# Altium project power-v3.2.PrjPCB (part 2 of 2)

## Sheet communication.SchDoc
size A4; SheetNumber: 8
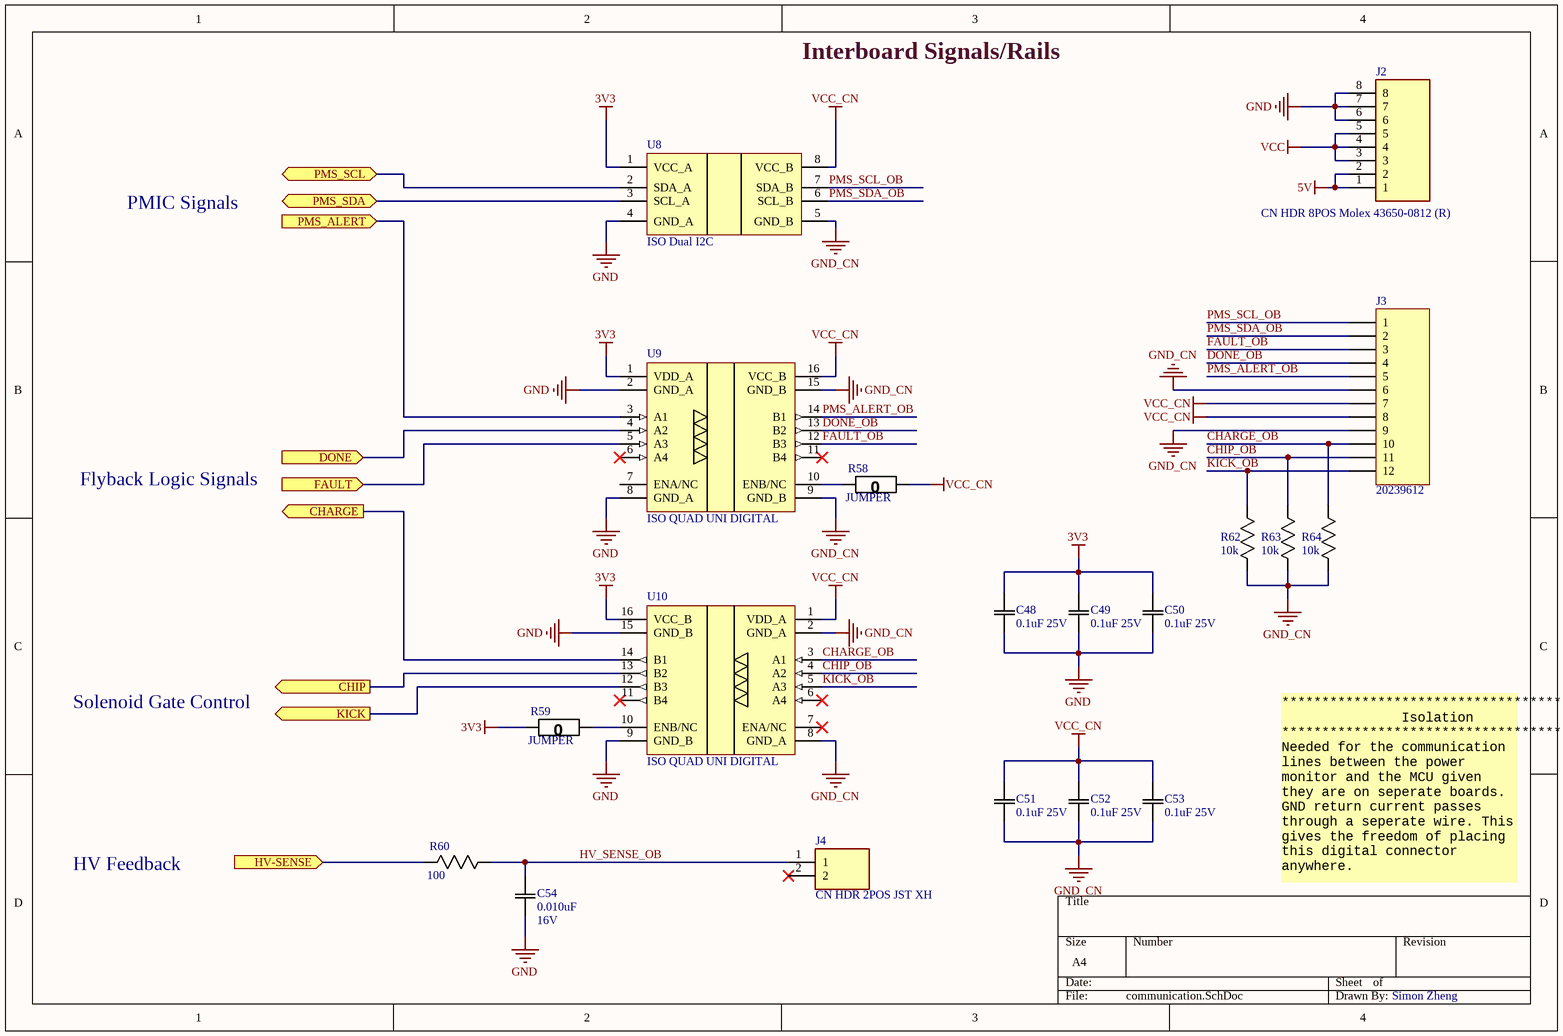
[diagram p6: communication.SchDoc]

### Parts
C48  0.1uF 25V  [0805]
C49  0.1uF 25V  [0805]
C50  0.1uF 25V  [0805]
C51  0.1uF 25V  [0805]
C52  0.1uF 25V  [0805]
C53  0.1uF 25V  [0805]
C54  Rating: 16V  [0805]  (hidden comment: 0.010uF)
J2  CN HDR 8POS Molex 43650-0812 (R)  [CN 43650-0812]
J3  20239612  [CN 20239612]
J4  CN HDR 2POS JST XH  [JST_S2B-XH-A(LF)(SN)]
R58  JUMPER  [0805]
R59  JUMPER  [0805]
R60  100  [0805]
R62  10k  [0805]
R63  10k  [0805]
R64  10k  [0805]
U8  ISO Dual I2C  [SOIC127P600X175-8N]
U9  ISO QUAD UNI DIGITAL  [SOIC127P600X175-16N]
U10  ISO QUAD UNI DIGITAL  [SOIC127P600X175-16N]

### Ports
CHARGE (out), CHIP (out), DONE (in), FAULT (in), HV-SENSE (in), KICK (out), PMS_ALERT (in), PMS_SCL (bidir), PMS_SDA (bidir)

### Nets
3V3: C48.1(C1) C49.1(C1) C50.1(C1) R59.2(R2) U8.1(VCC_A) U9.1(VDD_A) U10.16(VCC_B)
5V: J2.1 J2.2
GND: C48.2(C2) C49.2(C2) C50.2(C2) C54.2(C2) J2.6 J2.7 J2.8 U8.4(GND_A) U9.2(GND_A) U9.8(GND_A) U10.9(GND_B) U10.15(GND_B)
GND_CN: C51.2(C2) C52.2(C2) C53.2(C2) J3.6 J3.9 R62.2(R2) R63.2(R2) R64.2(R2) U8.5(GND_B) U9.9(GND_B) U9.15(GND_B) U10.2(GND_A) U10.8(GND_A)
VCC: J2.3 J2.4 J2.5
VCC_CN: C51.1(C1) C52.1(C1) C53.1(C1) J3.7 J3.8 R58.1(R1) U8.8(VCC_B) U9.16(VCC_B) U10.1(VDD_A)
CHARGE: U10.14(B1) ; port CHARGE
CHARGE_OB: J3.10 R64.1(R1) U10.3(A1)
CHIP: U10.13(B2) ; port CHIP
CHIP_OB: J3.11 R63.1(R1) U10.4(A2)
DONE: U9.4(A2) ; port DONE
DONE_OB: J3.4 U9.13(B2)
FAULT: U9.5(A3) ; port FAULT
FAULT_OB: J3.3 U9.12(B3)
HV-SENSE: R60.2(R2) ; port HV-SENSE
HV_SENSE_OB: C54.1(C1) J4.1 R60.1(R1)
KICK: U10.12(B3) ; port KICK
KICK_OB: J3.12 R62.1(R1) U10.5(A3)
PMS_ALERT: U9.3(A1) ; port PMS_ALERT
PMS_ALERT_OB: J3.5 U9.14(B1)
PMS_SCL: U8.2(SDA_A) ; port PMS_SCL
PMS_SCL_OB: J3.1 U8.7(SDA_B)
PMS_SDA: U8.3(SCL_A) ; port PMS_SDA
PMS_SDA_OB: J3.2 U8.6(SCL_B)
NetR58_2: R58.2(R2) U9.10(ENB/NC)
NetR59_1: R59.1(R1) U10.10(ENB/NC)

Not connected (* = marked no-connect by the designer): J4 2*; U9 6(A4)* 7(ENA/NC) 11(B4)*; U10 6(A4)* 7(ENA/NC)* 11(B4)*

### Notes on the sheet
- Interboard Signals/Rails
- PMIC Signals
- Flyback Logic Signals
- Solenoid Gate Control
- HV Feedback
- *********************************************
  Isolation
  *********************************************
  Needed for the communication lines between the power monitor and the MCU given they are on seperate boards. GND return current passes through a seperate wire. This gives the freedom of placing this digital connector anywhere.
- Simon Zheng

### Library data of the parts
C48-C53 = CAP 0.1uF 25V: CAP CER 0.1UF 25V X7R 0805; Tolerance: 10%; Value: 0.1uF; Temperature Coefficient: X7R; Rating: 25V; Operating Temperature: -55°C ~ 125°C
C54 = CAP 0.010uF 16V: CAP CER 0.010UF 16V X5R 0603/0805; Tolerance: 10%; Package: 0603/0805; Temperature Coefficient: X5R; Operating Temperature: -55°C ~ 85°C; Value: 0.010uF
J2 = CN HDR 8POS Molex 43650-0812 (R): Molex 43650-0812 8POS Microfit / single row, right angle, surface mount
J3 = CN Pico Clasp 12POS: 12 POS Right Angle Pico Clasp Surface Mount
J4 = CN HDR 2POS JST XH: Connector Header Through Hole 2 position 0.098 _2.50mm_ / JST XH; MP: B2B-XH-A_LF__SN_; MF: JST Sales; Price: None; Package: None; Value: *; Availability: Unavailable; SnapEDA_Link: https://www.snapeda.com/parts/B2B-XH-A%28LF%29%28SN%29/JST%20Sales%20America%20Inc./view-part/492310/?ref=snap
R58 R59 = RES 0 JUMPER: RES SMD 0 OHM JUMPER GENERIC 0805; Value: 0; Package: 0805
R60 = RES 100.0 1/8W: RES SMD 100 OHM 5% 1/8W 0805; Power (Watts): 0.125W; Package: 0805; Value: 100; Tolerance: 5%
R62-R64 = RES 10k 1/8W - 1%: RES SMD 10K OHM 1% 1/8W 0805; Power (Watts): 0.125W; Package: 0805; Value: 10k; Tolerance: 1%
U8 = ISO Dual I2C: Digital Isolation Dual Ch Bidirectional I2C; Revision: 1
U9 U10 = ISO QUAD UNI DIGITAL: Digital Isolation Quad Channel.; Revision: 1

## Nets that join several sheets
3V3: power-input (5 pins), regulation (C20.1 R20.1 U4.2), flyback (R35.2 R36.2), HV-Measurement (C40.2 C41.1 U6.5), communication (7 pins)
5V: regulation (9 pins), communication (J2.1 J2.2)
12V: regulation (10 pins), flyback (8 pins), chicker (C43.2 C44.1 C45.1 U7.6)
+HV: flyback (9 pins), auto-discharge (R45.2 R46.2), HV-Measurement (R50.2), chicker (D12.C D14.C P2.1 P3.1)
GND: power-input (8 pins), regulation (34 pins), flyback (30 pins), auto-discharge (D9.A Q4.S Q5.S R49.1), HV-Measurement (7 pins), chicker (12 pins), communication (12 pins)
VCC: power-input (R6.2 R8.1 R9.1 U1.8), regulation (5 pins), flyback (19 pins), auto-discharge (R48.2), communication (J2.3 J2.4 J2.5)